# EAGLE design radiationwatch-digipot1a_small (EAGLE 9.4.1)
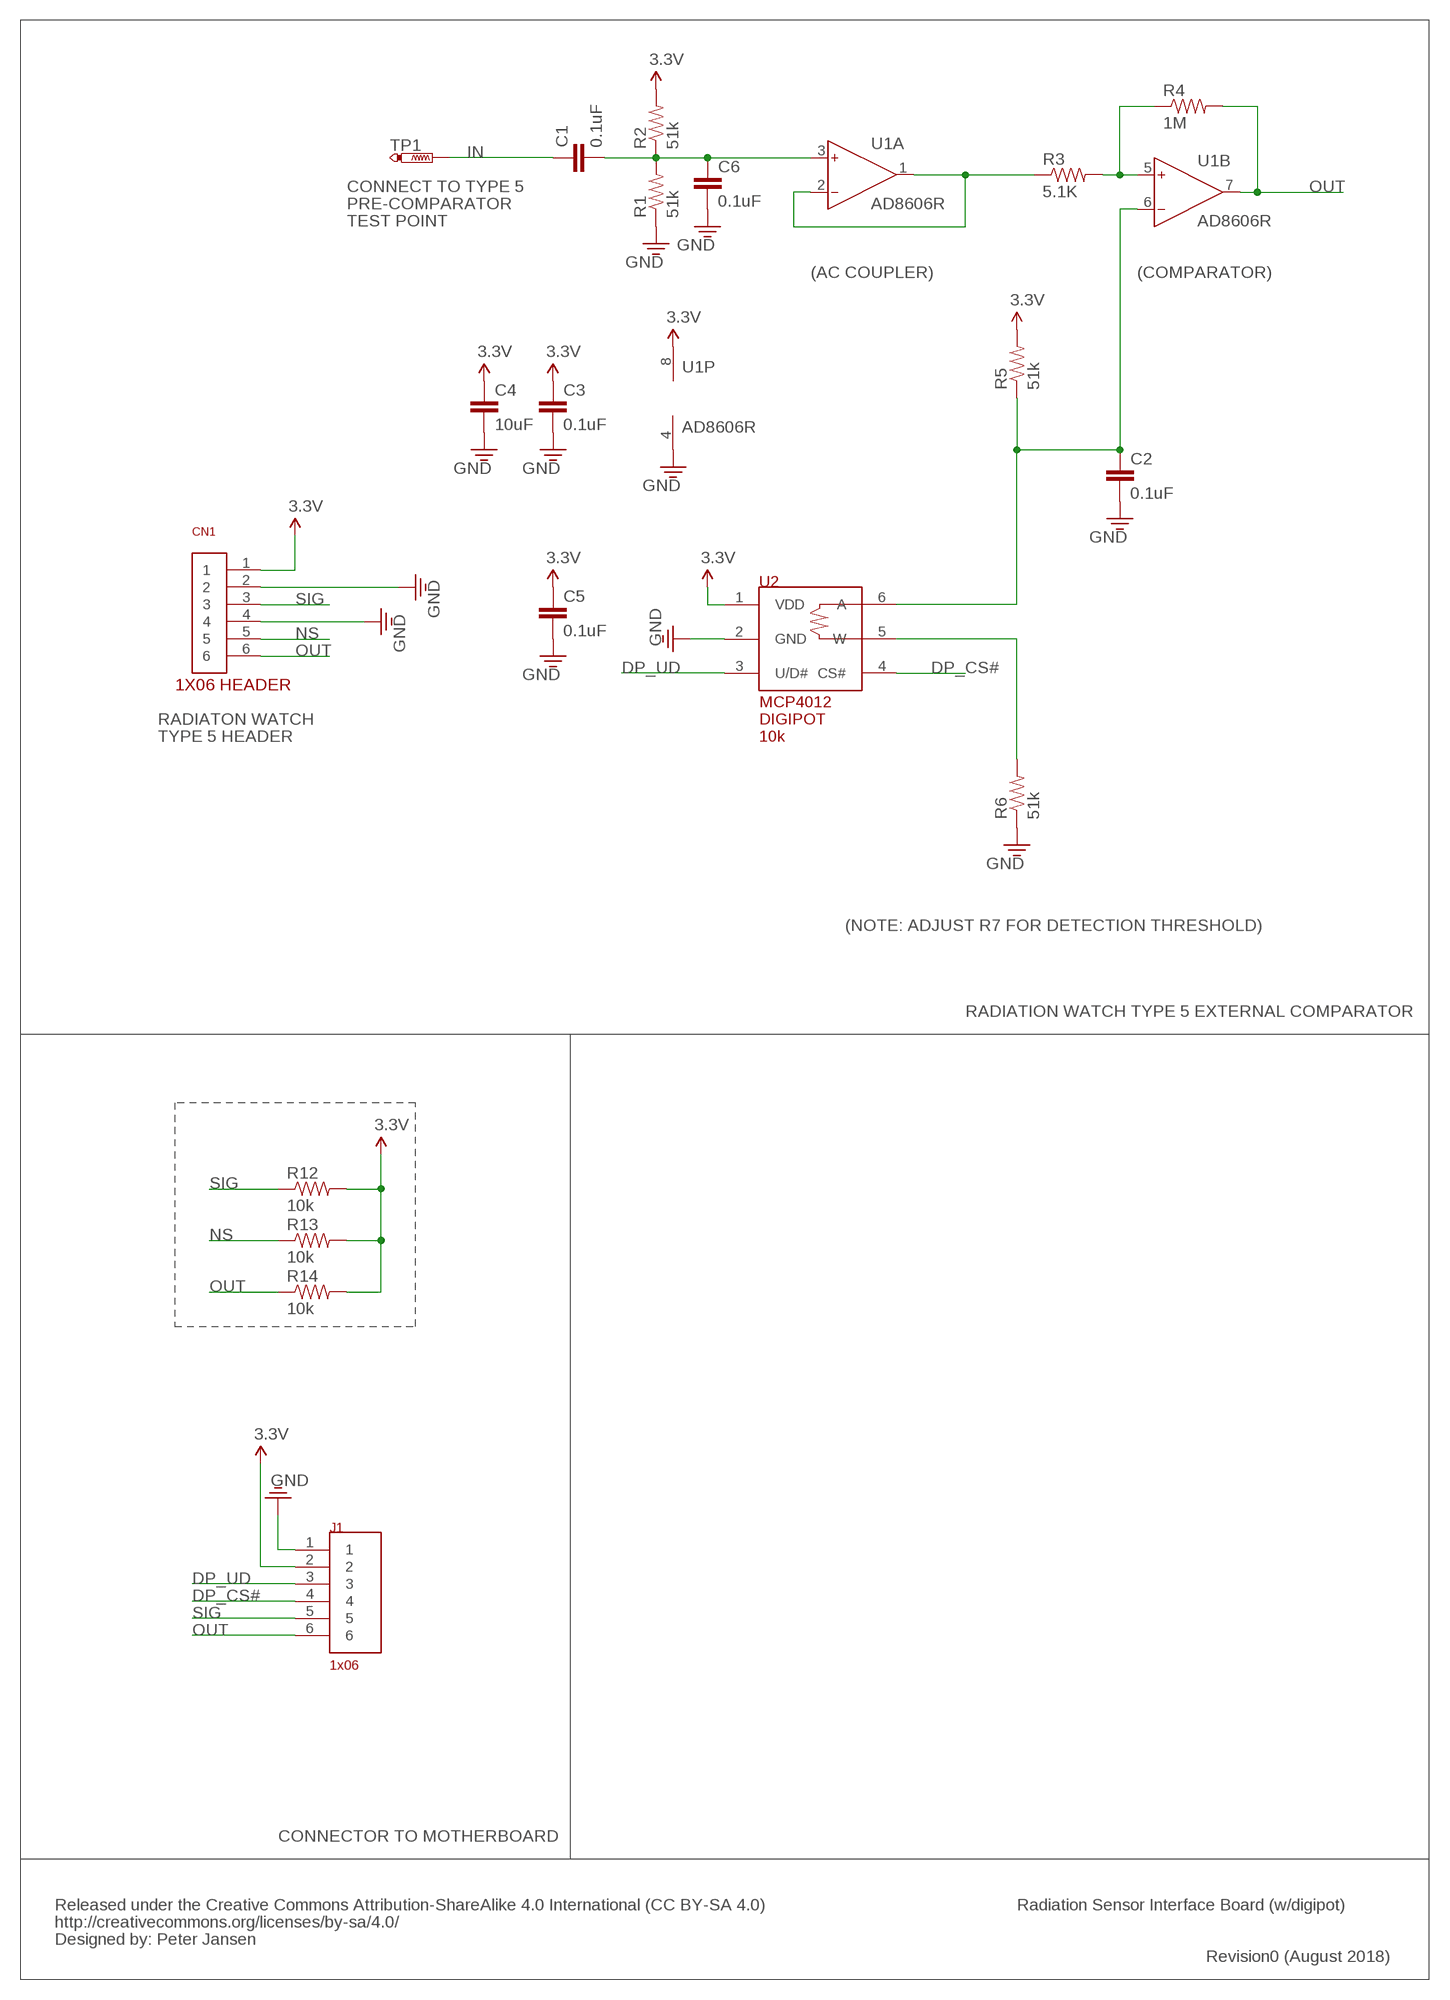
[diagram p0: schematic, sheet 1]

## Parts
C1  0.1uF  CAP0603  [0603]
C2  0.1uF  CAP0603  [0603]
C3  0.1uF  CAP0603  [0603]
C4  10uF  CAP0603  [0603]
C5  0.1uF  CAP0603  [0603]
C6  0.1uF  CAP0603  [0603]
CN1  1X06  [1X06]
J1  1X06  [JST-SM06B-1MM]
R1  51k  RESISTOR0603  [0603]
R2  51k  RESISTOR0603  [0603]
R3  5.1K  RESISTOR0603  [0603]
R4  1M  RESISTOR0603  [0603]
R5  51k  RESISTOR0603  [0603]
R6  51k  RESISTOR0603  [0603]
R12  10k  RESISTOR0603  [0603]
R13  10k  RESISTOR0603  [0603]
R14  10k  RESISTOR0603  [0603]
TP1  PTR1PAD1-13  [P1-13]
U1  AD8606R  AD8607R  [SO8]
U2  10k  MCP4012  [SOT-23-6]

## Nets
3.3V: C3.1 C4.1 C5.1 CN1.1 J1.2 R2.2 R5.2 R12.2 R13.2 R14.2 U1.8(P:V+) U2.1(VDD)
DP_CS#: J1.4 U2.4(CS#)
DP_UD: J1.3 U2.3(U/D#)
GND: C2.2 C3.2 C4.2 C5.2 C6.2 CN1.2 CN1.4 J1.1 R1.1 R6.1 U1.4(P:V-) U2.2(GND)
IN: C1.1 TP1.TP
N$1: R6.2 U2.5(W)
N$2: C1.2 C6.1 R1.2 R2.1 U1.3(A:IN+)
N$3: R3.1 U1.1(A:OUT) U1.2(A:IN-)
N$4: R3.2 R4.1 U1.5(B:IN+)
N$8: C2.1 R5.1 U1.6(B:IN-) U2.6(A)
NS: CN1.5 R13.1
OUT: CN1.6 J1.6 R4.2 R14.1 U1.7(B:OUT)
SIG: CN1.3 J1.5 R12.1

## Notes on the sheet
- CONNECT TO TYPE 5
- PRE-COMPARATOR
- TEST POINT
- (AC COUPLER) | (COMPARATOR)
- RADIATON WATCH
- TYPE 5 HEADER
- (NOTE: ADJUST R7 FOR DETECTION THRESHOLD)
- RADIATION WATCH TYPE 5 EXTERNAL COMPARATOR
- CONNECTOR TO MOTHERBOARD
- Released under the Creative Commons Attribution-ShareAlike 4.0 International (CC BY-SA 4.0) | Radiation Sensor Interface Board (w/digipot)
- http://creativecommons.org/licenses/by-sa/4.0/
- Designed by: Peter Jansen
- Revision0 (August 2018)

## Library data of the parts
C1-C6 = arm:CAP: Capacitor Standard 0603 ceramic capacitor, and 0.1" leaded capacitor.
CN1 = arm:1X06
J1 = notes:1X06
R1-R6 R12-R14 = arm:RESISTOR: Resistor Basic schematic elements and footprints for 0603, 1206, and PTH 1/10th watt (small) resistors.
TP1 = testpad:PTR1: TEST PIN
U1 = analog-devices:AD8607: Precision Micropower, Low Noise CMOS, Rail-to-Rail Input/Output Operational Amplifiers Source: http://www.analog.com/static/imported-files/data_sheets/AD8603_8607_8609.pdf; MPN: AD8607ARMZ-R2; OC_FARNELL: 1651293; OC_NEWARK: 19M8927
U2 = notes:MCP4012

## Board
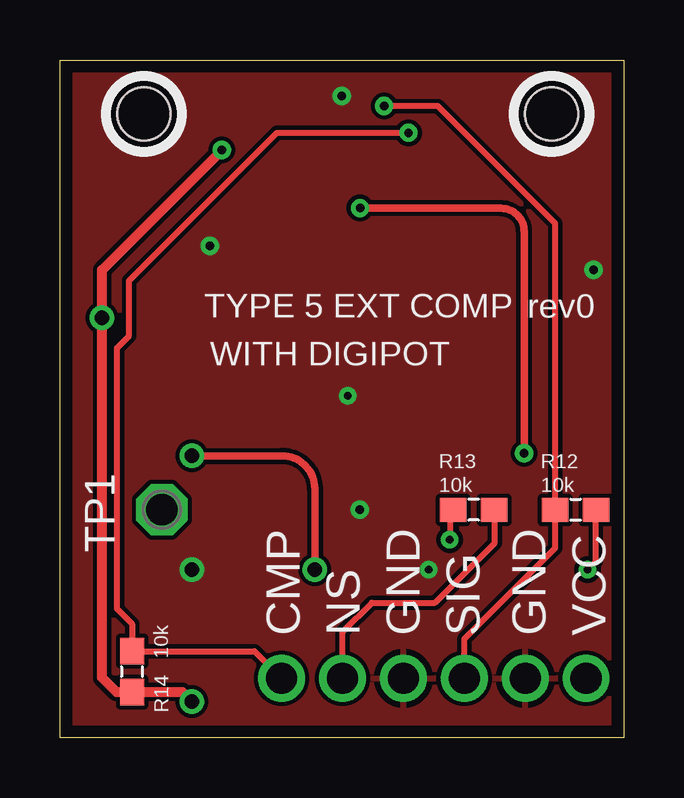
[diagram p1: board, top side]
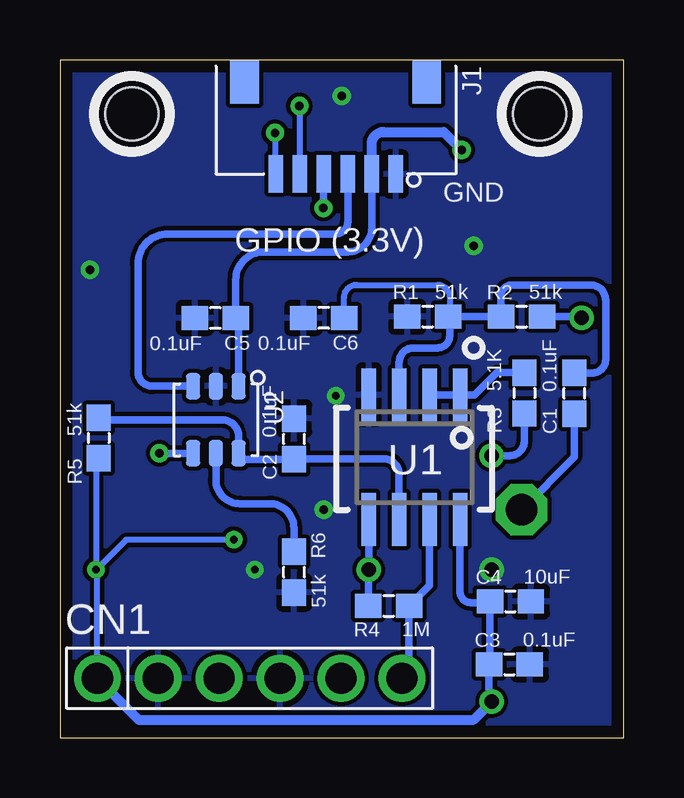
[diagram p2: board, bottom side, seen from below]

Size 23.5 x 28.25 mm. Coordinates in mm from the lower left corner, seen from the top.
Outline: 0,0 0,28.25 23.5,28.25 23.5,0 0,0
Copper layers (1*16): Top 0.035mm / dielectric 1.5mm / Bottom 0.035mm
Design rules "default *": minimum track width 8mil, minimum drill 13mil, track to track 7mil, track to pad 7mil, pad to pad 7mil, via to via 7mil, smd to smd 7mil, copper to edge 20mil, drill to drill 8mil, minimum pad ring 10mil, minimum via ring 8mil, stop-mask expansion 4mil, vias tented up to drill 0mil, thermal gap 10mil
Holes 2.2 mm at 20.5,26 3.5,26

### Footprints (pad centres in the part's own frame; a part is rotated, then mirrored left to right if it is on the bottom)
0603 = smd 1.1 x 1: 1 -0.85,0; 2 0.85,0
1X06 = drill 1.3: 1 0,0; 2 2.54,0; 3 5.08,0; 4 7.62,0; 5 10.16,0; 6 12.7,0
JST-SM06B-1MM = smd 0.6 x 1.55: 1 -2.5,0; 2 -1.5,0; 3 -0.5,0; 4 0.5,0; 5 1.5,0; 6 2.5,0 | smd 1.2 x 1.8: SHIELD1 -3.79,-3.83; SHIELD2 3.8,-3.83
P1-13 = drill 1.321 pad 2.159 octagon: TP 0,0
SO8 = smd 0.6 x 2.2: 1 -1.905,-2.6; 2 -0.635,-2.6; 3 0.635,-2.6; 4 1.905,-2.6; 5 1.905,2.6; 6 0.635,2.6; 7 -0.635,2.6; 8 -1.905,2.6
SOT-23-6 = smd 0.6 x 1.1: 1 -0.95,-1.4; 2 0,-1.4; 3 0.95,-1.4; 4 0.95,1.4; 5 0,1.4; 6 -0.95,1.4

### Placement (x,y rotation side)
C1  2.05,14.36 90 bottom
C2  13.73,12.45 90 bottom
C3  4.76,3.05 0 bottom
C4  4.71,5.67 0 bottom
C5  17.02,17.49 180 bottom
C6  12.5,17.5 180 bottom
CN1  21.94,2.47 0 bottom
J1  12,23.5 180 bottom
R1  8.17,17.55 0 bottom
R2  4.25,17.55 0 bottom
R3  4.14,14.36 270 bottom
R4  9.8,5.49 0 bottom
R5  21.89,12.49 270 bottom
R6  13.73,6.89 90 bottom
R12  21.5,9.5 0 top
R13  17.25,9.5 180 top
R14  3,2.75 270 top
TP1  4.25,9.5 180 top
U1  8.72,11.69 180 bottom
U2  17,13.25 180 bottom

### Tracks (layer width: path | path; a pad name or v marks a point on that pad's centre or on a via)
3.3V  (via drill 0.33, 0.35, 0.6)
  Top 0.254: v22,7 22.35,7.35 R12.2 | R13.2 16.25,9.35 v16.25,8.25
  Top 0.406: v5.5,1.5 5.1,1.9 R14.2 2.35,1.9 1.75,2.5 v1.75,17.5 1.75,19.5 v6.75,24.5
  Bottom 0.254: CN1.1 21.94,6.94 v22,7 | R5.2 22,12.03 v22,7 | v16.25,8.25 20.75,8.25 v22,7
  Bottom 0.305: U1.8 6.81,6.07 arc-90 6.38,5.62 5.62,5.62 arc-90 C4.1 | 5.3,5.67 C4.1 | C4.1 5.56,3.09 C3.1 5.61,1.64 v5.5,1.5 | v1.75,17.5 1.57,17.55 R2.2 | U2.1 16.05,17.37 C5.1 16.17,19.08 arc90 15,20.25 11.5,20.25 arc-90 10.5,21.25 J1.2
  Bottom 0.406: CN1.1 20.22,0.75 6.25,0.75 v5.5,1.5 | J1.2 10.5,24.75 arc90 10,25.25 7.5,25.25 v6.75,24.5
DP_CS#  (via drill 0.35)
  Top 0.305: v12.51,22.08 arc90 12.5,22.06 18.39,22.06 arc-90 19.36,21.1 v19.36,11.85
  Bottom 0.305: U2.4 v19.36,11.85 | v12.51,22.08 12.51,23.49 arc90 J1.4
DP_UD
  Bottom 0.305: U2.3 19.65,14.65 arc90 20.25,15.25 20.25,19.75 arc90 19,21 12,21 arc-90 11.5,21.5 J1.3
GND  (via drill 0.33, 0.35, 0.6)
  other vias: 5.5,7 15.38,7 12,14.25 11.75,26.75 6.25,20.5 22.25,19.5 12.5,9.5
  pour Bottom: 0.5,0 23.5,0 23.5,28.25 0.5,28.25
  pour Top: 0.5,28.25 0.5,0 23.5,0 23.5,28.25
IN
  Bottom 0.305: C1.1 2.05,11.7 TP1.TP
N$1
  Bottom 0.305: U2.5 17,10.75 arc-90 16,9.75 14.75,9.75 arc90 13.75,8.75 13.75,7.76 arc-90 R6.2
N$2
  Bottom 0.254: C6.1 11.65,18.35 arc90 11.12,18.88 7.75,18.88 arc90 7.25,18.38 7.25,17.62 arc90 R1.2
  Bottom 0.305: U1.3 9.36,15.64 arc90 8.75,16.25 7.75,16.25 arc-90 7.25,16.75 7.25,17.48 arc-90 R1.2 R2.1 arc90 5.12,17.57 5.12,18.38 arc90 4.62,18.88 1.38,18.88 arc90 0.75,18.25 0.75,15.75 arc90 1.29,15.2 C1.2
N$3
  Bottom 0.305: U1.2 U1.1 6.21,14.29 5.29,15.21 R3.1
N$4  (via drill 0.6)
  Top 0.305: v5.5,11.75 9.25,11.75 arc-90 10.62,10.38 v10.62,7
  Bottom 0.305: R3.2 4.14,12.36 arc90 4.75,11.75 v5.5,11.75 | U1.5 v10.62,7 arc-90 10.64,6.98 R4.1
N$8
  Bottom 0.305: U1.6 9.36,10.98 arc-90 10,11.62 13.51,11.62 C2.1 15.8,11.6 U2.6 16.05,12.55 arc-90 16.75,13.25 21.8,13.25 arc90 R5.1
NS
  Top 0.254: CN1.5 11.78,4.41 13,5.62 15.62,5.62 18.12,8.12 18.12,9.47 R13.1 18.12,9.53
OUT  (via drill 0.35)
  Top 0.254: CN1.6 8.11,3.6 R14.1 3,4.75 2.38,5.38 2.38,16.25 2.88,16.75 2.88,19.04 9.04,25.21 v14.53,25.21
  Bottom 0.254: 8.95,2.77 CN1.6 | v14.53,25.21 14.53,23.53 J1.6
  Bottom 0.305: 8.95,2.77 R4.2 8.09,6.34 U1.7
SIG  (via drill 0.35)
  Top 0.254: CN1.3 16.86,4.11 20.65,7.9 R12.1 20.65,21.43 15.75,26.33 v13.52,26.33
  Bottom 0.254: v13.52,26.33 13.52,23.52 J1.5

### Text on the board
tPlace: TYPE 5 EXT COMP | rev0 | WITH DIGIPOT | CMP | NS | GND | SIG | GND | VCC
bPlace: GND | GPIO (3.3V)